# Altium schematic sheet Connectors.SchDoc
size A
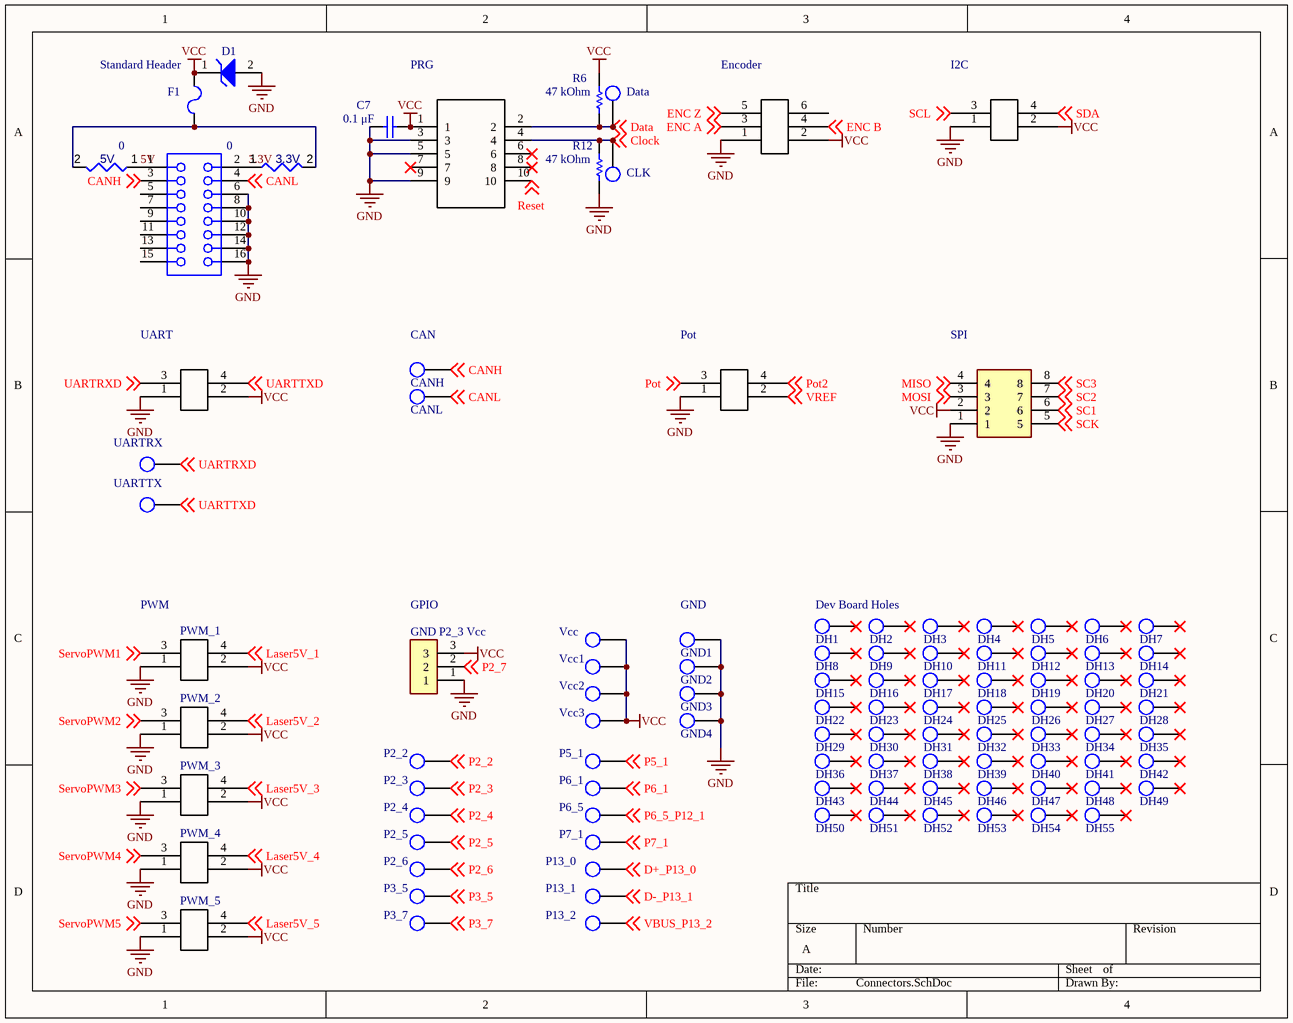
[diagram p0: Connectors.SchDoc]

## Parts
3.3V  value 0  [RESC0402(1005)_L]  (hidden comment: Jumper)
5V  value 0  [RESC0402(1005)_L]  (hidden comment: Jumper)
C7  0.1 μF  [Cap 0805]
CANH  Test Point  [Test Point Through-hole]  (value not drawn)
CANL  Test Point  [Test Point Through-hole]  (value not drawn)
CLK  Test Point  [Test Point pad]  (value not drawn)
D1  1SMB5917BT3G  [ONSC-SMB-2-403A-03_H_V]  (value not drawn)
Data  Test Point  [Test Point pad]  (value not drawn)
DH1  Test Point  [Test Point Through-hole]  (value not drawn)
DH2  Test Point  [Test Point Through-hole]  (value not drawn)
DH3  Test Point  [Test Point Through-hole]  (value not drawn)
DH4  Test Point  [Test Point Through-hole]  (value not drawn)
DH5  Test Point  [Test Point Through-hole]  (value not drawn)
DH6  Test Point  [Test Point Through-hole]  (value not drawn)
DH7  Test Point  [Test Point Through-hole]  (value not drawn)
DH8  Test Point  [Test Point Through-hole]  (value not drawn)
DH9  Test Point  [Test Point Through-hole]  (value not drawn)
DH10  Test Point  [Test Point Through-hole]  (value not drawn)
DH11  Test Point  [Test Point Through-hole]  (value not drawn)
DH12  Test Point  [Test Point Through-hole]  (value not drawn)
DH13  Test Point  [Test Point Through-hole]  (value not drawn)
DH14  Test Point  [Test Point Through-hole]  (value not drawn)
DH15  Test Point  [Test Point Through-hole]  (value not drawn)
DH16  Test Point  [Test Point Through-hole]  (value not drawn)
DH17  Test Point  [Test Point Through-hole]  (value not drawn)
DH18  Test Point  [Test Point Through-hole]  (value not drawn)
DH19  Test Point  [Test Point Through-hole]  (value not drawn)
DH20  Test Point  [Test Point Through-hole]  (value not drawn)
DH21  Test Point  [Test Point Through-hole]  (value not drawn)
DH22  Test Point  [Test Point Through-hole]  (value not drawn)
DH23  Test Point  [Test Point Through-hole]  (value not drawn)
DH24  Test Point  [Test Point Through-hole]  (value not drawn)
DH25  Test Point  [Test Point Through-hole]  (value not drawn)
DH26  Test Point  [Test Point Through-hole]  (value not drawn)
DH27  Test Point  [Test Point Through-hole]  (value not drawn)
DH28  Test Point  [Test Point Through-hole]  (value not drawn)
DH29  Test Point  [Test Point Through-hole]  (value not drawn)
DH30  Test Point  [Test Point Through-hole]  (value not drawn)
DH31  Test Point  [Test Point Through-hole]  (value not drawn)
DH32  Test Point  [Test Point Through-hole]  (value not drawn)
DH33  Test Point  [Test Point Through-hole]  (value not drawn)
DH34  Test Point  [Test Point Through-hole]  (value not drawn)
DH35  Test Point  [Test Point Through-hole]  (value not drawn)
DH36  Test Point  [Test Point Through-hole]  (value not drawn)
DH37  Test Point  [Test Point Through-hole]  (value not drawn)
DH38  Test Point  [Test Point Through-hole]  (value not drawn)
DH39  Test Point  [Test Point Through-hole]  (value not drawn)
DH40  Test Point  [Test Point Through-hole]  (value not drawn)
DH41  Test Point  [Test Point Through-hole]  (value not drawn)
DH42  Test Point  [Test Point Through-hole]  (value not drawn)
DH43  Test Point  [Test Point Through-hole]  (value not drawn)
DH44  Test Point  [Test Point Through-hole]  (value not drawn)
DH45  Test Point  [Test Point Through-hole]  (value not drawn)
DH46  Test Point  [Test Point Through-hole]  (value not drawn)
DH47  Test Point  [Test Point Through-hole]  (value not drawn)
DH48  Test Point  [Test Point Through-hole]  (value not drawn)
DH49  Test Point  [Test Point Through-hole]  (value not drawn)
DH50  Test Point  [Test Point Through-hole]  (value not drawn)
DH51  Test Point  [Test Point Through-hole]  (value not drawn)
DH52  Test Point  [Test Point Through-hole]  (value not drawn)
DH53  Test Point  [Test Point Through-hole]  (value not drawn)
DH54  Test Point  [Test Point Through-hole]  (value not drawn)
DH55  Test Point  [Test Point Through-hole]  (value not drawn)
Encoder  Molex Micro  [MICROFIT R/A 6 PIN]  (value not drawn)
F1  MF-NSMF150-2  [BOUR-MF-NSMF150-2_V]  (value not drawn)
GND1  Test Point  [Test Point Through-hole]  (value not drawn)
GND2  Test Point  [Test Point Through-hole]  (value not drawn)
GND3  Test Point  [Test Point Through-hole]  (value not drawn)
GND4  Test Point  [Test Point Through-hole]  (value not drawn)
GND_P2_3_Vcc  1985836  [PHOENIX_1985836]  (value not drawn)
I2C  Molex Micro  [MICROFIT R/A 4 PIN]  (value not drawn)
P2_2  Test Point  [Test Point Through-hole]  (value not drawn)
P2_3  Test Point  [Test Point Through-hole]  (value not drawn)
P2_4  Test Point  [Test Point Through-hole]  (value not drawn)
P2_5  Test Point  [Test Point Through-hole]  (value not drawn)
P2_6  Test Point  [Test Point Through-hole]  (value not drawn)
P3_5  Test Point  [Test Point Through-hole]  (value not drawn)
P3_7  Test Point  [Test Point Through-hole]  (value not drawn)
P5_1  Test Point  [Test Point Through-hole]  (value not drawn)
P6_1  Test Point  [Test Point Through-hole]  (value not drawn)
P6_5  Test Point  [Test Point Through-hole]  (value not drawn)
P7_1  Test Point  [Test Point Through-hole]  (value not drawn)
P13_0  Test Point  [Test Point Through-hole]  (value not drawn)
P13_1  Test Point  [Test Point Through-hole]  (value not drawn)
P13_2  Test Point  [Test Point Through-hole]  (value not drawn)
Pot  Molex Micro  [MICROFIT R/A 4 PIN]  (value not drawn)
PRG  Programming Header  [programming3D]  (value not drawn)
PWM_1  Molex Micro  [MICROFIT R/A 4 PIN]  (value not drawn)
PWM_2  Molex Micro  [MICROFIT R/A 4 PIN]  (value not drawn)
PWM_3  Molex Micro  [MICROFIT R/A 4 PIN]  (value not drawn)
PWM_4  Molex Micro  [MICROFIT R/A 4 PIN]  (value not drawn)
PWM_5  Molex Micro  [MICROFIT R/A 4 PIN]  (value not drawn)
R6  47 kOhm  [RESC0805(2012)_N]
R12  47 kOhm  [RESC0805(2012)_N]
SPI  Molex micro-fit 8-pin  [MICROFIT R/A 8 PIN]  (value not drawn)
Standard_Header  Stacking Header  [SMTC-SSQ-108-02-X-D]  (value not drawn)
UART  Molex Micro  [MICROFIT R/A 4 PIN]  (value not drawn)
UARTRX  Test Point  [Test Point Through-hole]  (value not drawn)
UARTTX  Test Point  [Test Point Through-hole]  (value not drawn)
Vcc  Test Point  [Test Point Through-hole]  (value not drawn)
Vcc1  Test Point  [Test Point Through-hole]  (value not drawn)
Vcc2  Test Point  [Test Point Through-hole]  (value not drawn)
Vcc3  Test Point  [Test Point Through-hole]  (value not drawn)

## Nets
GND: C7.1 D1.2(A) Encoder.1 GND1.1 GND2.1 GND3.1 GND4.1 GND_P2_3_Vcc.1 I2C.1 Pot.1 PRG.3 PRG.5 PRG.9 PWM_1.1 PWM_2.1 PWM_3.1 PWM_4.1 PWM_5.1 R12.1 SPI.1 Standard_Header.6 Standard_Header.8 Standard_Header.10 Standard_Header.12 Standard_Header.14 Standard_Header.16 UART.1
VCC: C7.2 D1.1(K) Encoder.2 F1.2 GND_P2_3_Vcc.3 I2C.2 PRG.1 PWM_1.2 PWM_2.2 PWM_3.2 PWM_4.2 PWM_5.2 R6.2 SPI.2 UART.2 Vcc.1 Vcc1.1 Vcc2.1 Vcc3.1
3.3V: 3.3V.1 Standard_Header.2
5V: 5V.1 Standard_Header.1
CANH: CANH.1 Standard_Header.3 ; off-sheet CANH
CANL: CANL.1 Standard_Header.4 ; off-sheet CANL
Clock: CLK.1 PRG.4 R12.2 ; off-sheet Clock
D+_P13_0: P13_0.1 ; off-sheet D+_P13_0
D-_P13_1: P13_1.1 ; off-sheet D-_P13_1
Data: Data.1 PRG.2 R6.1 ; off-sheet Data
ENC A: Encoder.3 ; off-sheet ENC A
ENC B: Encoder.4 ; off-sheet ENC B
ENC Z: Encoder.5 ; off-sheet ENC Z
Laser5V_1: PWM_1.4 ; off-sheet Laser5V_1
Laser5V_2: PWM_2.4 ; off-sheet Laser5V_2
Laser5V_3: PWM_3.4 ; off-sheet Laser5V_3
Laser5V_4: PWM_4.4 ; off-sheet Laser5V_4
Laser5V_5: PWM_5.4 ; off-sheet Laser5V_5
MISO: SPI.4 ; off-sheet MISO
MOSI: SPI.3 ; off-sheet MOSI
P2_2: P2_2.1 ; off-sheet P2_2
P2_3: P2_3.1 ; off-sheet P2_3
P2_4: P2_4.1 ; off-sheet P2_4
P2_5: P2_5.1 ; off-sheet P2_5
P2_6: P2_6.1 ; off-sheet P2_6
P2_7: GND_P2_3_Vcc.2 ; off-sheet P2_7
P3_5: P3_5.1 ; off-sheet P3_5
P3_7: P3_7.1 ; off-sheet P3_7
P5_1: P5_1.1 ; off-sheet P5_1
P6_1: P6_1.1 ; off-sheet P6_1
P6_5_P12_1: P6_5.1 ; off-sheet P6_5_P12_1
P7_1: P7_1.1 ; off-sheet P7_1
Pot: Pot.3 ; off-sheet Pot
Pot2: Pot.4 ; off-sheet Pot2
Reset: PRG.10 ; off-sheet Reset
SC1: SPI.6 ; off-sheet SC1
SC2: SPI.7 ; off-sheet SC2
SC3: SPI.8 ; off-sheet SC3
SCK: SPI.5 ; off-sheet SCK
SCL: I2C.3 ; off-sheet SCL
SDA: I2C.4 ; off-sheet SDA
ServoPWM1: PWM_1.3 ; off-sheet ServoPWM1
ServoPWM2: PWM_2.3 ; off-sheet ServoPWM2
ServoPWM3: PWM_3.3 ; off-sheet ServoPWM3
ServoPWM4: PWM_4.3 ; off-sheet ServoPWM4
ServoPWM5: PWM_5.3 ; off-sheet ServoPWM5
UARTRXD: UART.3 UARTRX.1 ; off-sheet UARTRXD
UARTTXD: UART.4 UARTTX.1 ; off-sheet UARTTXD
VBUS_P13_2: P13_2.1 ; off-sheet VBUS_P13_2
VREF: Pot.2 ; off-sheet VREF
Net3.3V_2: 3.3V.2 5V.2 F1.1

Not connected (* = marked no-connect by the designer): DH1 1*; DH2 1*; DH3 1*; DH4 1*; DH5 1*; DH6 1*; DH7 1*; DH8 1*; DH9 1*; DH10 1*; DH11 1*; DH12 1*; DH13 1*; DH14 1*; DH15 1*; DH16 1*; DH17 1*; DH18 1*; DH19 1*; DH20 1*; DH21 1*; DH22 1*; DH23 1*; DH24 1*; DH25 1*; DH26 1*; DH27 1*; DH28 1*; DH29 1*; DH30 1*; DH31 1*; DH32 1*; DH33 1*; DH34 1*; DH35 1*; DH36 1*; DH37 1*; DH38 1*; DH39 1*; DH40 1*; DH41 1*; DH42 1*; DH43 1*; DH44 1*; DH45 1*; DH46 1*; DH47 1*; DH48 1*; DH49 1*; DH50 1*; DH51 1*; DH52 1*; DH53 1*; DH54 1*; DH55 1*; Encoder 6; PRG 6* 7* 8*; Standard_Header 5 7 9 11 13 15

## Notes on the sheet
- (near CANH) CAN
- (near PWM_1) PWM
- (near GND_P2_3_Vcc) GPIO
- (near GND1) GND
- Dev Board Holes

## Library data of the parts
3.3V 5V = CMP-009-00062-1: Jumper 0402 (1005 Metric); Pins: 2; Case/Package: 0402; Mounting Technology: SMT
C7 = Capacitor 0805: Standard Capacitor; Mounting Technology: SurfaceMount; Case Size/Dimension: 0805; Package Reference: 0805; Capacitance: 0.1 μF
D1 = Zener Diode 5.1V: 3 W Zener Voltage Regulator, 2-Pin SMB, Pb-Free, Tape and Reel; Manufacturer: On Semiconductor; VZ Typ (V): 4.7; RoHS: Pb-Free; ComponentLink1Description: Manufacturer URL; ComponentLink2URL: http://www.onsemi.com/pub_link/Collateral/1SMB5913BT3-D.PDF; Mounting Technology: Surface Mount; PackageVersion: Rev. H, 05/2011; DatasheetVersion: Rev. 8; Packing: Tape and Reel; PartNumber: 1SMB5917BT3G; ComponentLink2Description: Datasheet; ComponentLink3Description: Package Specification; PackageReference: SMB-2-403A-03_H; ComponentLink1URL: http://www.onsemi.com/; PackageDescription: 2-Pin Small Molded Package, J-Bend Lead, Body 4.33 x 3.625 mm; ComponentLink3URL: http://www.onsemi.com/pub_link/Collateral/1SMB5913BT3-D.PDF
Encoder = Molex micro-fit 6-pin (dual row schematic): Molex micro-fit 3.0 dual row connector. P/N 0430450627
F1 = CMP-2000-06693-1: PTC Resettable Fuse, 6 V, 100 A, -40 to 85 degC, 2-Pin SMD, RoHS, Tape and Reel; Manufacturer: Bourns; Trip Current: 3A; Maximum Voltage DC: 6V; Current Rating: 100A; Resistance: 130mOhms; Type: PTCResettableFuses; Hold Current: 1.5A; Maximum Voltage: 6VDC; RoHS: Details; Current Rating (Max): 100A; Datasheet URL: http://www.bourns.com/docs/Product-Datasheets/mfnsmf.pdf; Package Description: 2-Pin Surface Mount Device, Body 3.2 x 1.6 mm; Series: MF-NSMF; Mounting Technology: SurfaceMount; Dimensions: 3.4mmLx1.8mmWx0.7mmH; Termination Style: SMD/SMT; Datasheet Version: Rev. T, 08/2015; Package / Case: 1206(3216metric); Manufacturer URL: http://www.bourns.com/; Product Category: ResettableFuses-PPTC; Packaging: Reel; Brand: Bourns; Mounting Style: SMD/SMT; Package Reference: MF-NSMF150-2; Current Rating - Max: 100A; Tradename: Multifuse; Factory Pack Quantity: 3000; Operating Temperature Range: -40Cto+85C
GND_P2_3_Vcc = 1985836: 3 Position Wire to Board Terminal Block Horizontal with Board 0.150 _3.81mm_ Through Hole; MF: Phoenix Contact; Value: *; Package: None; Price: None; MP: 1985836; Availability: Unavailable; SnapEDA_Link: https://www.snapeda.com/parts/1985836/Phoenix%20Contact/view-part/2770711/?ref=snap
I2C Pot PWM_1-PWM_5 UART = Molex micro-fit 4-pin (dual row schematic): Molex micro-fit 3.0, P/N 0430450427
R6 R12 = Resistor 0805: Generic 0805 Resistor; Case-EIA: 0805; Technology: SMT; Value: 47 kOhm
Standard_Header = Stacking Header: SQ Post Socket, Through-hole, Vertical, -55 to 125 degC, 2.54 mm Pitch, 16-Pin, Female, RoHS; Manufacturer: Samtec; PartNumber: SSQ-108-02-G-D; Pitch: 2.54 mm; ComponentLink2URL: http://www.samtec.com/documents/webfiles/pdf/SSQ_TH.PDF; ComponentLink3Description: Package Specification; Mounting Technology: Through-hole; RoHS: True; PackageReference: SSQ-108-02-X-D; Orientation: Vertical; ComponentLink1URL: http://www.samtec.com; DatasheetVersion: F-214; Temperature Range: -55 to 125 degC; PackageDescription: Assembly, Socket Strip .025[0.64] SQ Tail; PackageVersion: BD, 6/1987; ComponentLink2Description: Datasheet; ComponentLink1Description: Manufacturer URL; ComponentLink3URL: http://www.samtec.com/documents/webfiles/cpdf/SSQ-1XX-XX-XXX-X-XX-XXX-XX-X-MKT.pdf